# EAGLE design interface_dac_sma_feedback_3PS_LM317_ADC_detector (EAGLE 7.2.0)
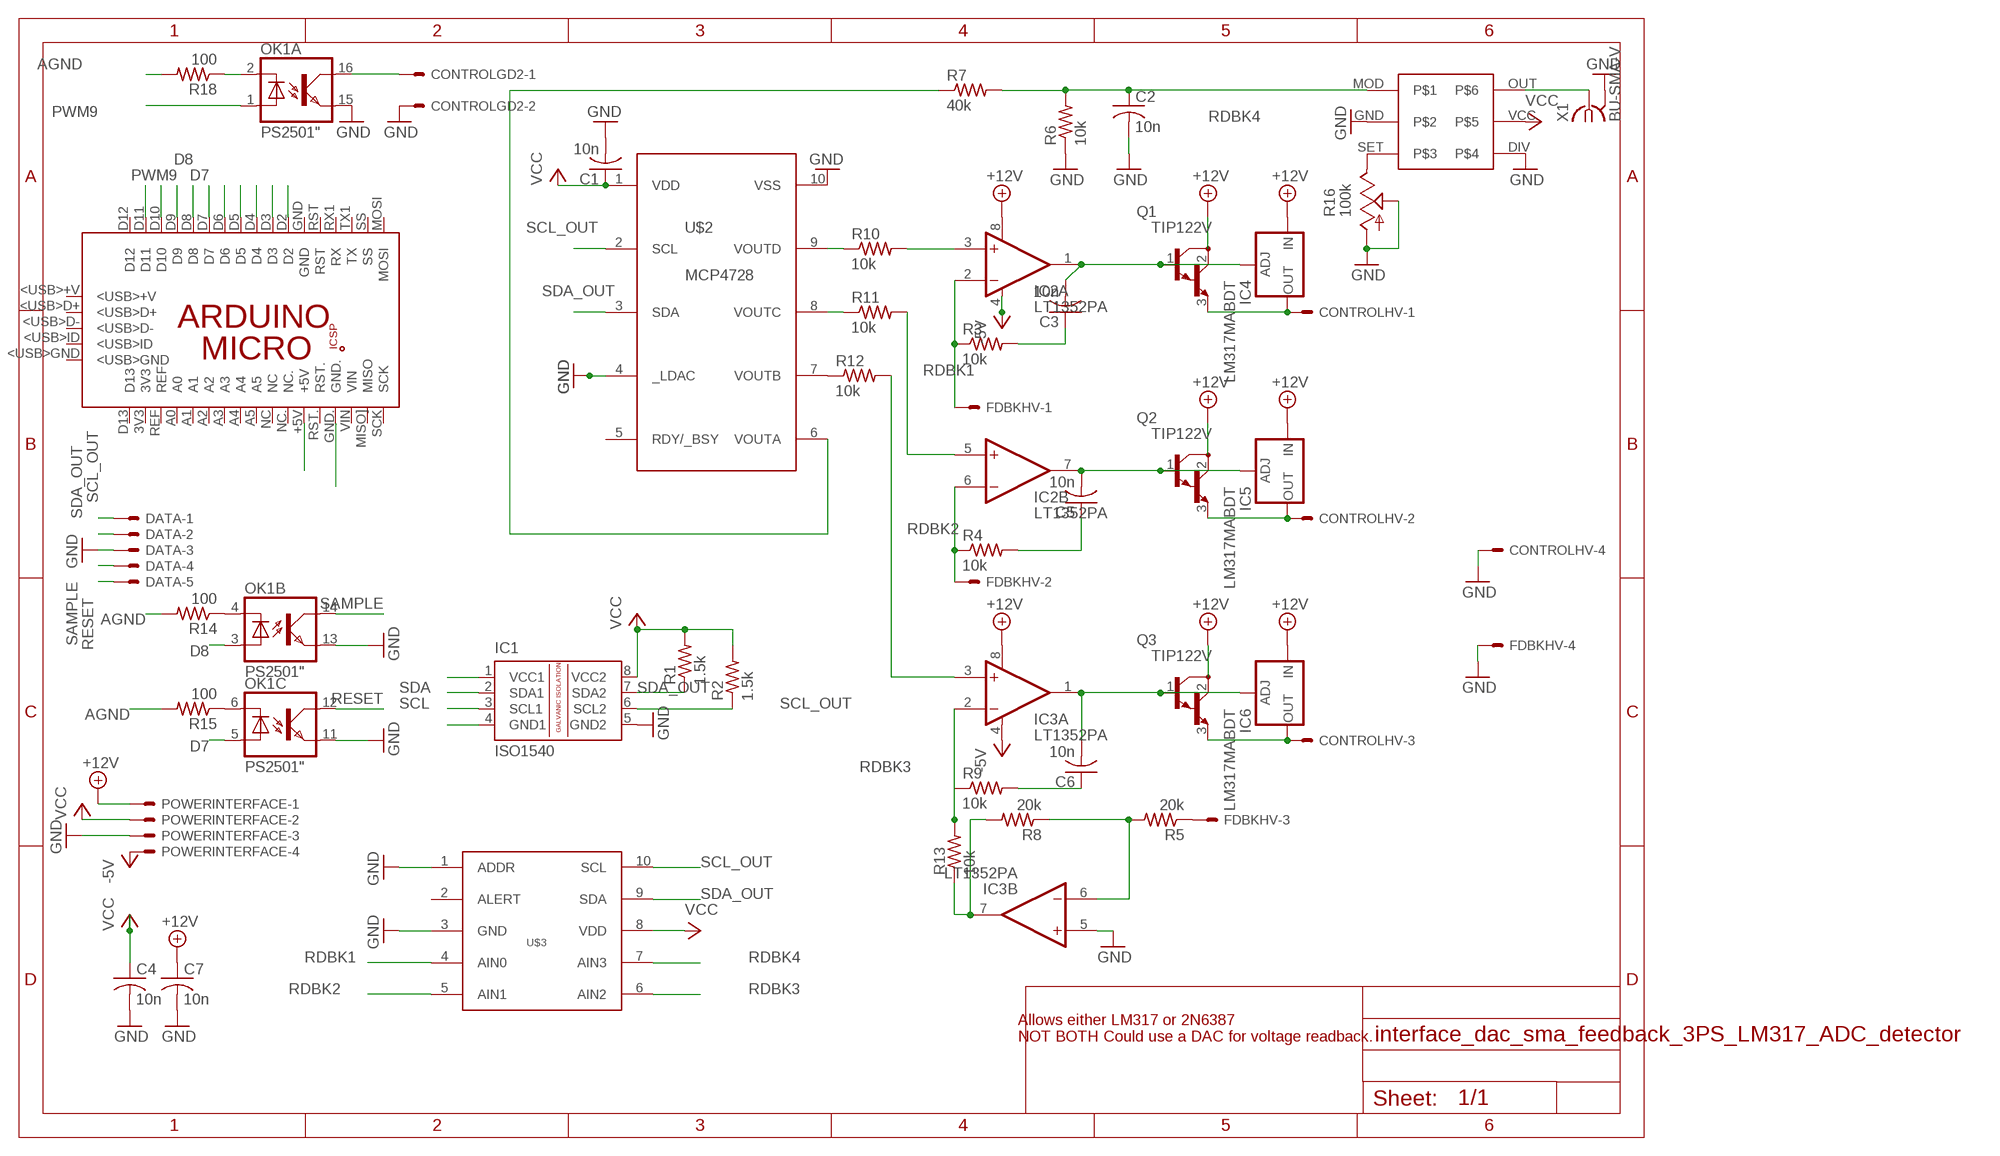
[diagram p0: schematic, sheet 1]

## Parts
C1  10n  C-US050-024X044  [C050-024X044]
C2  10n  C-US050-024X044  [C050-024X044]
C3  10n  C-US050-024X044  [C050-024X044]
C4  10n  C-US050-024X044  [C050-024X044]
C5  10n  C-US050-024X044  [C050-024X044]
C6  10n  C-US050-024X044  [C050-024X044]
C7  10n  C-US050-024X044  [C050-024X044]
CONTROLGD2  KK-156-2  [KK-156-2]
CONTROLHV  KK-156-4  [KK-156-4]
DATA  KK-156-5  [KK-156-5]
FDBKHV  KK-156-4  [KK-156-4]
IC1  ISO1540  [DIL08]
IC2  LT1352PA  [DIL08]
IC3  LT1352PA  [DIL08]
IC4  LM317MABDT  [DPACK]
IC5  LM317MABDT  [DPACK]
IC6  LM317MABDT  [DPACK]
OK1  PS2501"  [DIL16]
PCB1  ARDUINO_MICRO  [ARDUINO_MICRO]
POWERINTERFACE  KK-156-4  [KK-156-4]
Q1  TIP122V  [TO220V]
Q2  TIP122V  [TO220V]
Q3  TIP122V  [TO220V]
R1  1.5k  R-US_0207/12  [0207/12]
R2  1.5k  R-US_0207/12  [0207/12]
R3  10k  R-US_0207/12  [0207/12]
R4  10k  R-US_0207/12  [0207/12]
R5  20k  R-US_0207/12  [0207/12]
R6  10k  R-US_0207/12  [0207/12]
R7  40k  R-US_0207/12  [0207/12]
R8  20k  R-US_0207/12  [0207/12]
R9  10k  R-US_0207/12  [0207/12]
R10  10k  R-US_0207/12  [0207/12]
R11  10k  R-US_0207/12  [0207/12]
R12  10k  R-US_0207/12  [0207/12]
R13  10k  R-US_0207/12  [0207/12]
R14  100  R-US_0207/12  [0207/12]
R15  100  R-US_0207/12  [0207/12]
R16  100k  TRIM_US-B90P  [SP19L]
R18  100  R-US_0207/12  [0207/12]
U$1  LTC6992  [DIL06]
U$2  MCP4728DIL  [DIL10]
U$3  ADS1015DIL  [DIL10]
X1  BU-SMA-V  [BU-SMA-V]

## Nets
+12V: C7.1 IC2.8(A:V+) IC3.8(A:V+) IC4.3(IN) IC5.3(IN) IC6.3(IN) POWERINTERFACE.1 Q1.2(C) Q2.2(C) Q3.2(C)
-5V: IC2.4(A:V-) IC3.4(A:V-) POWERINTERFACE.4
A+5: IC1.1(VCC1) PCB1.+5V
AGND: IC1.4(GND1) PCB1.GND. R14.2 R15.2 R18.2
D4: PCB1.D4
D7: OK1.5(C:A) PCB1.D7
D8: OK1.3(B:A) PCB1.D8
D10: PCB1.D10
D11: PCB1.D11
ENSW2: CONTROLGD2.1 OK1.16(A:COL)
GND: C1.2 C2.2 C4.2 C7.2 CONTROLGD2.2 CONTROLHV.4 DATA.3 FDBKHV.4 IC1.5(GND2) IC3.5(B:+IN) OK1.11(C:EMI) OK1.13(B:EMI) OK1.15(A:EMI) POWERINTERFACE.3 R6.1 R16.A R16.S U$1.DIV U$1.GND U$2.4(_LDAC) U$2.10(VSS) U$3.1(ADDR) U$3.3(GND) X1.2 X1.3 X1.4 X1.5
N$1: R7.1 U$2.6(VOUTA)
N$2: OK1.4(B:C) R14.1
N$3: C3.1 R3.2
N$4: CONTROLHV.1 IC4.4(OUT) Q1.3(E)
N$5: CONTROLHV.3 IC6.4(OUT) Q3.3(E)
N$6: OK1.6(C:C) R15.1
N$7: OK1.2(A:C) R18.1
N$9: FDBKHV.3 R5.1
N$10: C5.2 IC2.7(B:OUT) IC5.1(ADJ) Q2.1(B)
N$11: CONTROLHV.2 IC5.4(OUT) Q2.3(E)
N$12: R16.E U$1.SET
N$13: U$1.OUT X1.1
N$14: IC3.7(B:OUT) R8.2 R13.1
N$15: C5.1 R4.2
N$16: IC2.3(A:+IN) R10.2
N$17: IC2.5(B:+IN) R11.2
N$18: IC3.3(A:+IN) R12.2
N$19: C3.2 IC2.1(A:OUT) IC4.1(ADJ) Q1.1(B)
N$20: C6.1 R9.2
N$21: C6.2 IC3.1(A:OUT) IC6.1(ADJ) Q3.1(B)
N$23: IC3.6(B:-IN) R5.2 R8.1
N$24: R10.1 U$2.9(VOUTD)
N$25: R12.1 U$2.7(VOUTB)
N$26: R11.1 U$2.8(VOUTC)
PWM5: PCB1.D5
PWM6: PCB1.D6
PWM9: OK1.1(A:A) PCB1.D9
RDBK1: FDBKHV.1 IC2.2(A:-IN) R3.1 U$3.4(AIN0)
RDBK2: FDBKHV.2 IC2.6(B:-IN) R4.1 U$3.5(AIN1)
RDBK3: IC3.2(A:-IN) R9.1 R13.2 U$3.6(AIN2)
RDBK4: C2.1 R6.2 R7.2 U$1.MOD U$3.7(AIN3)
RESET: DATA.5 OK1.12(C:COL)
SAMPLE: DATA.4 OK1.14(B:COL)
SCL: IC1.3(SCL1) PCB1.D3
SCL_OUT: DATA.1 IC1.6(SCL2) R2.1 U$2.2(SCL) U$3.10(SCL)
SDA: IC1.2(SDA1) PCB1.D2
SDA_OUT: DATA.2 IC1.7(SDA2) R1.1 U$2.3(SDA) U$3.9(SDA)
VCC: C1.1 C4.1 IC1.8(VCC2) POWERINTERFACE.2 R1.2 R2.2 U$1.VCC U$2.1(VDD) U$3.8(VDD)
Unconnected: OK1.7(D:A) OK1.8(D:C) OK1.9(D:EMI) OK1.10(D:COL) PCB1.3V3 PCB1.5V PCB1.<USB>+V PCB1.<USB>D+ PCB1.<USB>D- PCB1.<USB>GND PCB1.<USB>ID PCB1.A0 PCB1.A1 PCB1.A2 PCB1.A3 PCB1.A4 PCB1.A5 PCB1.D12 PCB1.D13 PCB1.GND PCB1.GND_ PCB1.MISO. PCB1.MISO](MISO) PCB1.MOSI PCB1.MOSI. PCB1.NC PCB1.NC. PCB1.REF PCB1.RESET.. PCB1.RST PCB1.RST. PCB1.RX1(RX) PCB1.SCK PCB1.SCK. PCB1.SS PCB1.TX1(TX) PCB1.VIN U$2.5(RDY/_BSY) U$3.2(ALERT)

## Notes on the sheet
- Allows either LM317 or 2N6387
  NOT BOTH Could use a DAC for voltage readback.

## Library data of the parts
C1 = rcl:C-US: CAPACITOR, American symbol
C2-C7 = resistor:C-US: CAPACITOR, American symbol
CONTROLGD2 = con-molex:KK-156-2: KK 156 HEADER Source: http://www.molex.com/pdm_docs/sd/026604100_sd.pdf; OC_FARNELL: unknown; OC_NEWARK: unknown
CONTROLHV FDBKHV POWERINTERFACE = con-molex:KK-156-4: KK 156 HEADER Source: http://www.molex.com/pdm_docs/sd/026604100_sd.pdf; OC_FARNELL: unknown; OC_NEWARK: unknown
DATA = con-molex:KK-156-5: KK 156 HEADER Source: http://www.molex.com/pdm_docs/sd/026604100_sd.pdf; OC_FARNELL: unknown; OC_NEWARK: unknown
IC1 = texas:ISO1540: ISOLATED CAN TRANSCEIVER Source: http://focus.ti.com/lit/ds/symlink/iso1050.pdf
IC2 IC3 = linear-technology:LT1352: Dual Operational Amplifiers Source: http://datasheets.maxim-ic.com/en/ds/ICL7612-ICL764X.pdf; OC_FARNELL: unknown; OC_NEWARK: unknown
IC4-IC6 = v-reg:LM317?*: 500 mA Adjustable Output Positive Voltage Regulator Source: http://www.onsemi.co.jp .. LM317M-D.PDF
OK1 = optocoupler:PS2501: SHARP OPTO COUPLER
PCB1 = E14_Arduino_published:ARDUINO_MICRO: Device for representing an Arduino Micro board with a footprint in an EAGLE design. Created by Dave Young for Element14. More EAGLE documentation at: http://www.element14.com/community/community/knode/cadsoft_eagle
Q1-Q3 = transistor-npn:TIP122*: NPN Darlington Transistor
R1-R13 = resistor:R-US_: RESISTOR, American symbol
R14 R15 R18 = rcl:R-US_: RESISTOR, American symbol
R16 = pot:TRIM_US-: POTENTIOMETER
U$1 = linear-technology:LTC6992
U$2 = microchip:MCP4728
U$3 = texas:ADS1015
X1 = con-coax:BU-SMA-V: FEMALE SMA CONNECTOR Radiall distributor RS 112-3794; OC_FARNELL: unknown; OC_NEWARK: unknown

## Board
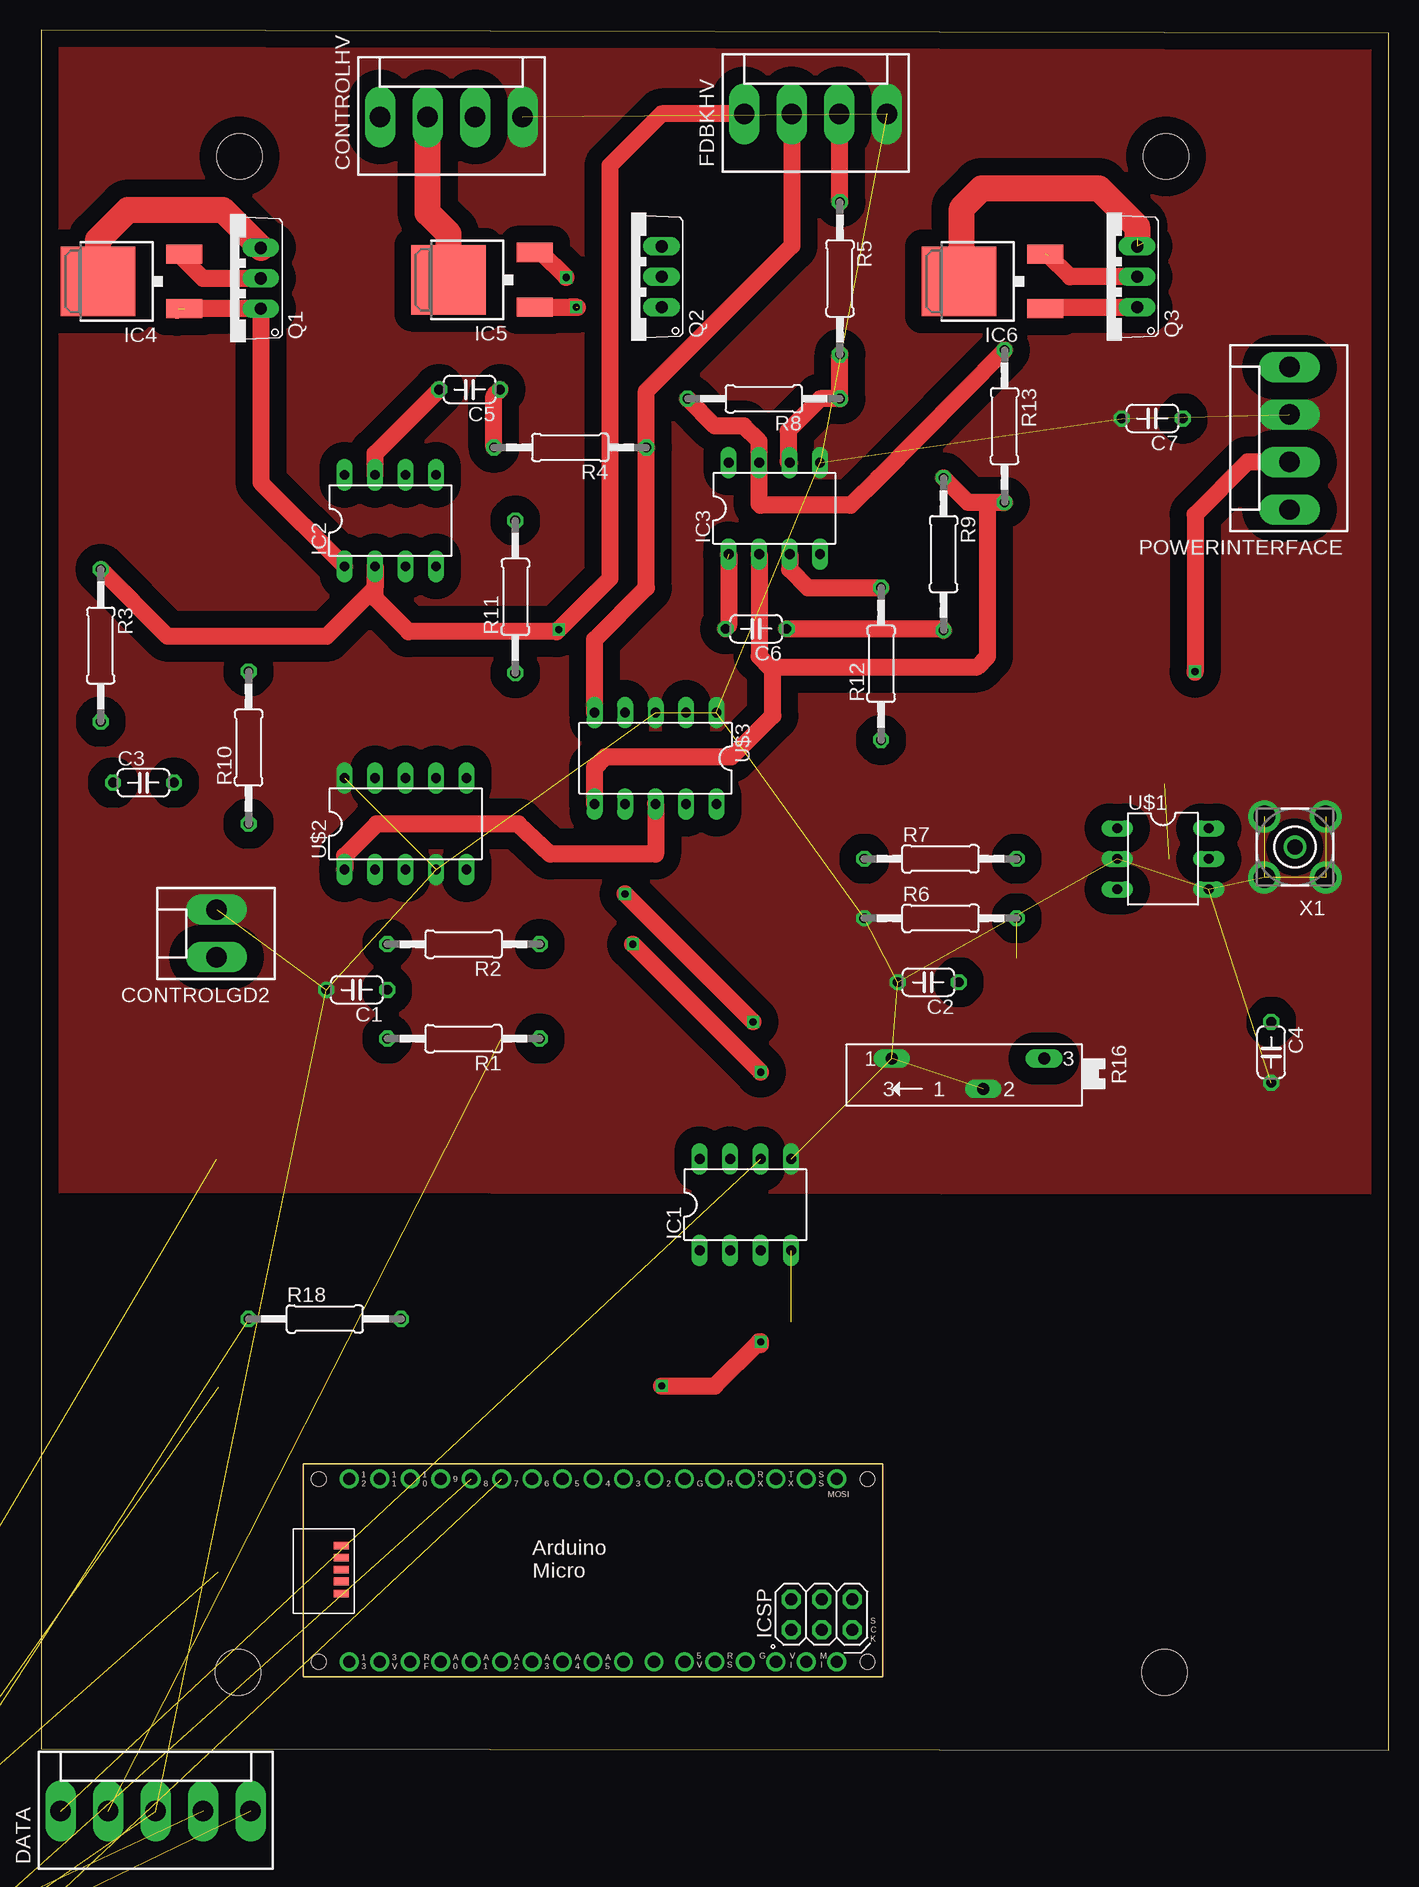
[diagram p1: board, top side]
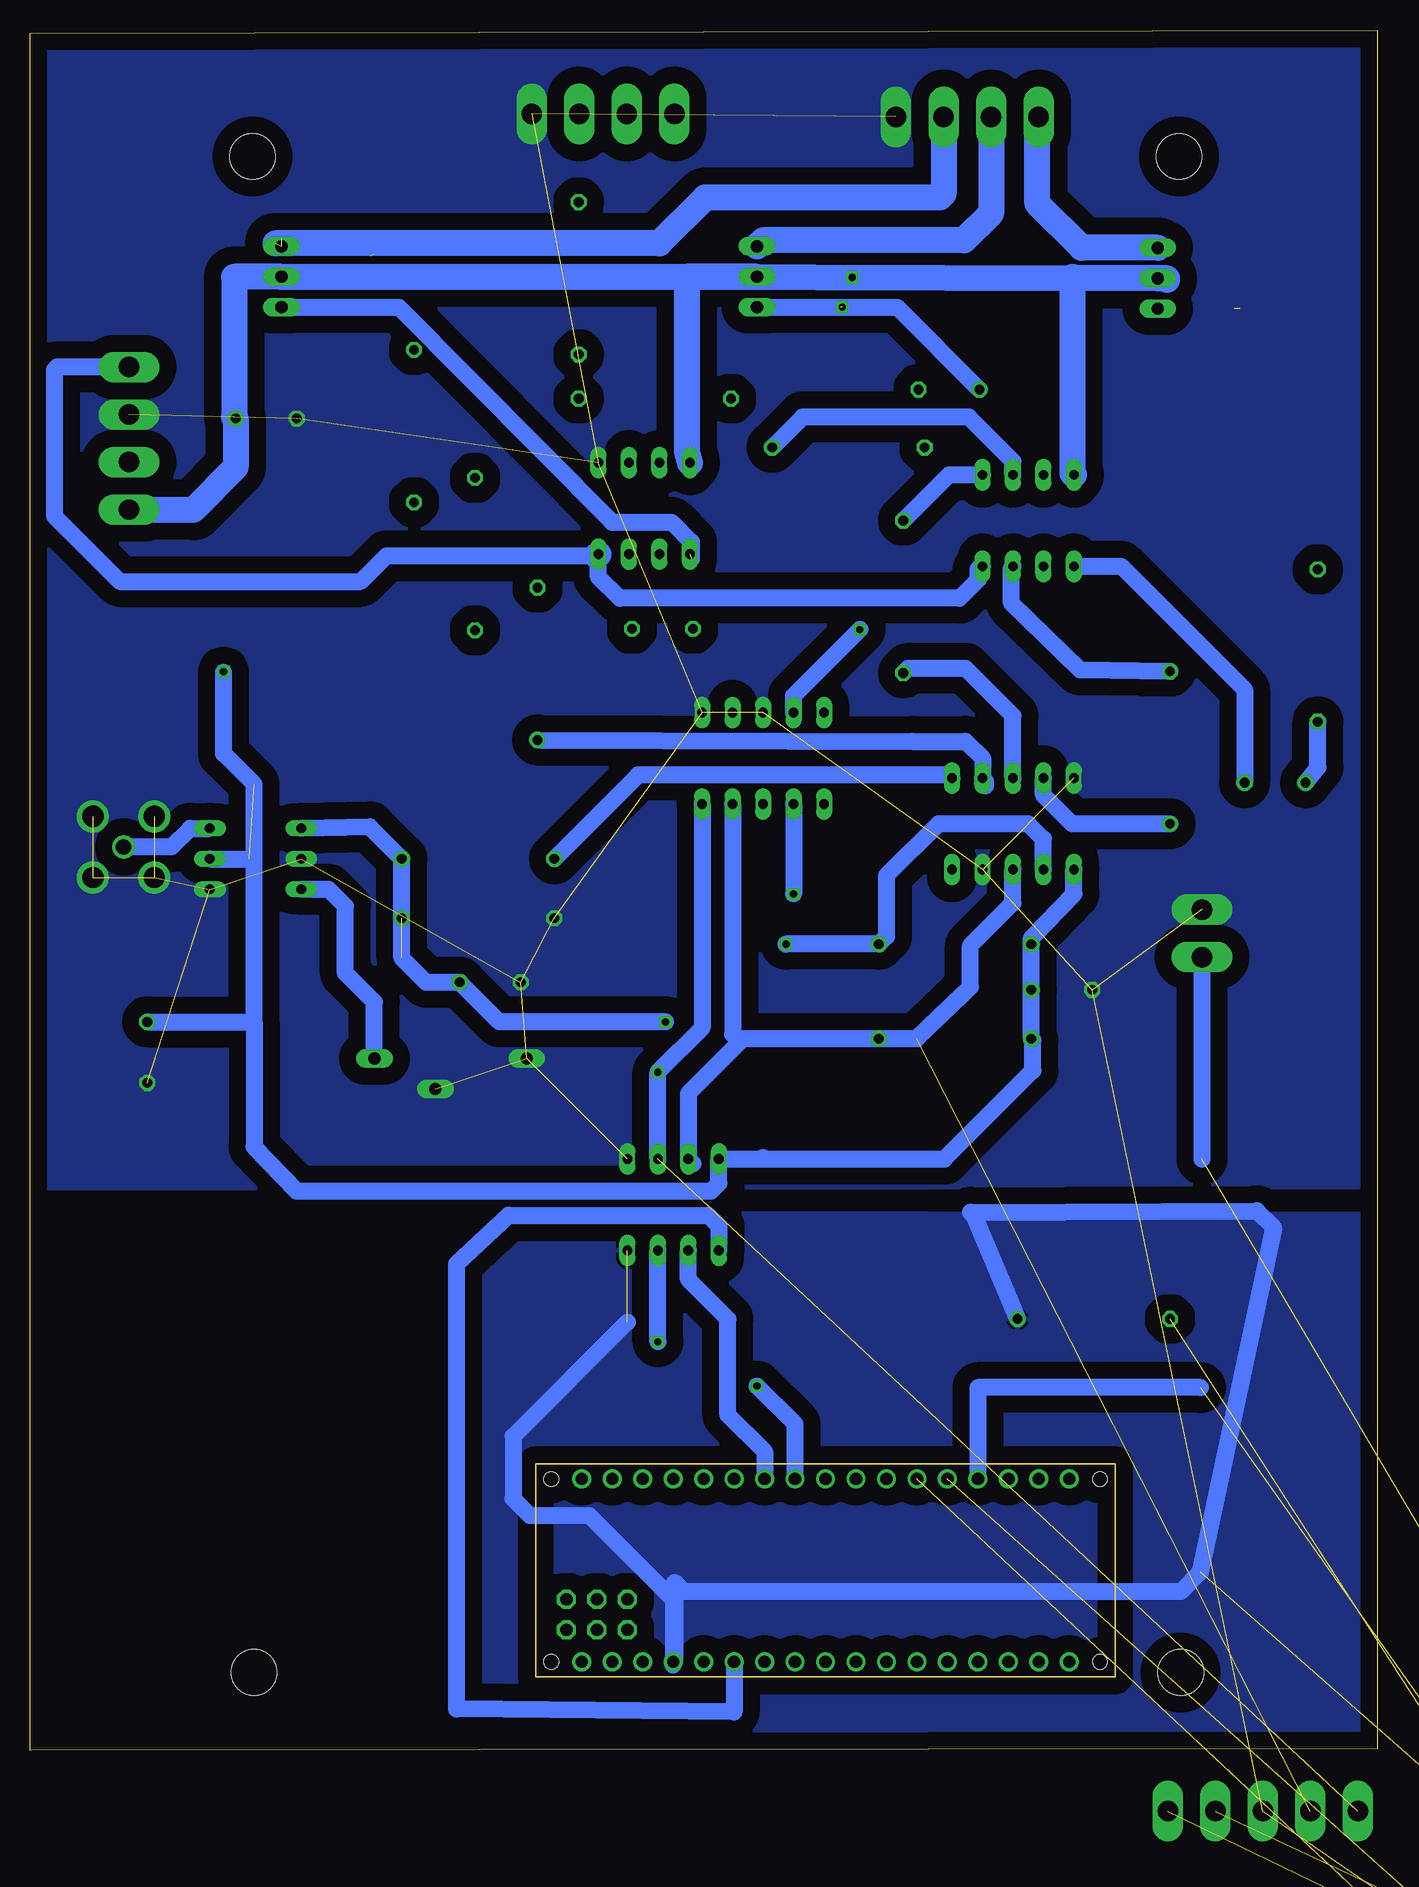
[diagram p2: board, bottom side, seen from below]

Size 112.27 x 143.38 mm. Coordinates in mm from the lower left corner, seen from the top.
Outline: 0,0.13 112.27,0 112.27,143.13 0,143.38 0,0.13
Copper layers (1*16): Top 0.035mm / dielectric 1.5mm / Bottom 0.035mm
Design rules "default *": minimum track width 6mil, minimum drill 15mil, track to track 6mil, track to pad 6mil, pad to pad 6mil, via to via 6mil, smd to smd 6mil, copper to edge 40mil, drill to drill 8mil, minimum pad ring 10mil, minimum via ring 8mil, stop-mask expansion 4mil, vias tented up to drill 0mil, thermal gap 10mil
Holes 3.8 mm at 93.6,6.48 93.73,132.84 16.51,132.84 16.38,6.48

### Footprints (pad centres in the part's own frame; a part is rotated, then mirrored left to right if it is on the bottom)
C050-024X044 = drill 0.813 octagon: 1 -2.54,0; 2 2.54,0
KK-156-2 = drill 1.7 pad 2.184 long: 1 -1.98,0; 2 1.98,0
KK-156-4 = drill 1.7 pad 2.184 long: 1 -5.94,0; 2 -1.98,0; 3 1.98,0; 4 5.94,0
KK-156-5 = drill 1.7 pad 2.184 long: 1 -7.92,0; 2 -3.96,0; 3 0,0; 4 3.96,0; 5 7.92,0
DIL08 = drill 0.813 long: 1 -3.81,-3.81; 2 -1.27,-3.81; 3 1.27,-3.81; 4 3.81,-3.81; 5 3.81,3.81; 6 1.27,3.81; 7 -1.27,3.81; 8 -3.81,3.81
DPACK = smd 1.6 x 3: 1 -2.28,-4.8; 3 2.28,-4.8 | smd 5.8 x 6.2: 4 0,2.38
DIL16 = drill 0.813 offset: 1 -8.89,-3.81; 2 -6.35,-3.81; 3 -3.81,-3.81; 4 -1.27,-3.81; 5 1.27,-3.81; 6 3.81,-3.81; 7 6.35,-3.81; 8 8.89,-3.81; 9 8.89,3.81; 10 6.35,3.81; 11 3.81,3.81; 12 1.27,3.81; 13 -1.27,3.81; 14 -3.81,3.81; 15 -6.35,3.81; 16 -8.89,3.81
ARDUINO_MICRO = drill 1.016 pad 1.575: 3V3 6.35,1.27; +5V 31.75,1.27; A0 11.43,1.27; A1 13.97,1.27; A2 16.51,1.27; A3 19.05,1.27; A4 21.59,1.27; A5 24.13,1.27; D2 29.21,16.51; D3 26.67,16.51; D4 24.13,16.51; D5 21.59,16.51; D6 19.05,16.51; D7 16.51,16.51; D8 13.97,16.51; D9 11.43,16.51; D10 8.89,16.51; D11 6.35,16.51; D12 3.81,16.51; D13 3.81,1.27; GND 31.75,16.51; GND. 36.83,1.27; MISO] 41.91,1.27; MOSI 44.45,16.51; NC 26.67,1.27; NC. 29.21,1.27; REF 8.89,1.27; RST 34.29,16.51; RST. 34.29,1.27; RX1 36.83,16.51; SCK 44.45,1.27; SS 41.91,16.51; TX1 39.37,16.51; VIN 39.37,1.27 | drill 1.016 pad 1.575 octagon: 5V 40.64,6.477; GND_ 45.72,6.477; MISO. 40.64,3.937; MOSI. 43.18,6.477; RESET.. 45.72,3.937; SCK. 43.18,3.937 | smd 1.27 x 0.635: <USB>+V 3.15,10.947; <USB>D+ 3.15,9.957; <USB>D- 3.15,8.941; <USB>GND 3.15,6.96; <USB>ID 3.15,7.976 | hole 1.2: 1.27,1.27; 1.27,16.51; 46.99,16.51; 46.99,1.27
TO220V = drill 1.016 long: 1 -2.54,-2.54; 2 0,-2.54; 3 2.54,-2.54
0207/12 = drill 0.813 octagon: 1 -6.35,0; 2 6.35,0
SP19L = drill 1.016 long: A 5.715,-1.27; E -6.985,-1.27; S -1.905,1.27
DIL06 = drill 0.813 long: DIV 2.54,3.81; GND 0,-3.81; MOD -2.54,-3.81; OUT -2.54,3.81; SET 2.54,-3.81; VCC 0,3.81
DIL10 = drill 0.813 long: 1 -5.08,-3.81; 2 -2.54,-3.81; 3 0,-3.81; 4 2.54,-3.81; 5 5.08,-3.81; 6 5.08,3.81; 7 2.54,3.81; 8 0,3.81; 9 -2.54,3.81; 10 -5.08,3.81
BU-SMA-V = drill 1.27: 1 0,0 | drill 1.778: 2 -2.55,2.55; 3 2.55,2.55; 4 2.55,-2.55; 5 -2.55,-2.55

### Placement (x,y rotation side)
C1  26.29,63.37 180 top
C2  73.91,64.01 180 top
C3  8.51,80.64 0 top
C4  102.49,58.17 270 top
C5  35.69,113.41 180 top
C6  59.56,93.47 180 top
C7  92.58,111 180 top
CONTROLGD2  14.61,68.07 90 top
CONTROLHV  34.16,136.14 0 top
DATA  9.53,-5.08 0 top  (outside the outline)
FDBKHV  64.52,136.4 0 top
IC1  58.67,45.47 0 top
IC2  29.08,102.49 0 top
IC3  61.09,103.5 0 top
IC4  7.11,122.43 90 top
IC5  36.32,122.55 90 top
IC6  78.87,122.43 90 top
OK1  -18.54,-25.65 0 top  (outside the outline)
PCB1  21.84,6.1 0 top
POWERINTERFACE  104.01,109.35 90 top
Q1  15.75,122.68 90 top
Q2  49.15,122.81 90 top
Q3  88.77,122.81 90 top
R1  35.18,59.31 180 top
R2  35.18,67.18 180 top
R3  4.95,92.07 270 top
R4  44.07,108.58 180 top
R5  66.55,122.68 270 top
R6  74.93,69.34 0 top
R7  74.93,74.3 0 top
R8  60.2,112.65 180 top
R9  75.18,99.69 270 top
R10  17.27,83.57 90 top
R11  39.5,96.14 90 top
R12  69.98,90.55 90 top
R13  80.26,110.36 270 top
R14  -23.5,-13.21 0 top  (outside the outline)
R15  -23.5,-17.53 0 top  (outside the outline)
R16  76.58,56.39 180 top
R18  23.62,35.94 0 top
U$1  93.47,74.3 270 top
U$2  30.35,77.22 0 top
U$3  51.18,82.68 180 top
X1  104.47,75.29 180 top

### Tracks (layer width: path | path; a pad name or v marks a point on that pad's centre or on a via)
+12V  (via drill 0.6)  (1 unrouted)
  Top 1.422: IC4.3 11.91,124.23 13.46,122.68 Q1.2 | IC5.3 41.66,124.83 v43.74,122.76 | Q3.2 85.72,122.81 83.95,124.59 83.19,124.59
  Bottom 1.422: v43.74,122.76 51.64,122.76 Q2.2
  Bottom 2.184: 57.53,122.81 Q3.2 95.25,122.81 95.25,111.12 C7.1 95.12,106.93 98.68,103.38 98.71,103.41 POWERINTERFACE.1 | 57.53,122.81 25.27,122.68 | Q1.2 17.53,122.68 17.53,122.58 | Q1.2 25.27,122.68 | 25.27,122.68 25.4,122.81 25.4,106.43 IC2.8 | Q2.2 57.53,122.81 | 57.53,122.81 57.53,108.2 IC3.8 | 17.53,122.55 Q1.2
-5V
  Bottom 1.422: IC2.4 33.02,98.68 33.27,98.42 33.27,97.54 34.8,96.01 63.12,96.01 64.9,97.79 IC3.4 | POWERINTERFACE.4 110.01,115.29 110.24,115.06 110.24,102.87 104.78,97.41 84.71,97.41 82.55,99.57 65.02,99.57
  Bottom 2.184: 65.02,99.57 IC3.4
A+5
  Bottom 1.422: PCB1.+5V 53.59,3.17 76.71,3.43 76.71,40.51 72.39,44.58 55.75,44.58 54.86,43.69 IC1.1
AGND  (3 unrouted)
  Bottom 1.422: 62.48,35.69 72.01,26.16 72.01,20.95 70.61,19.56 65.66,19.56 58.67,12.57 PCB1.GND. | PCB1.GND. 58.67,7.11 | R18.2 33.53,44.45 33.91,44.83 10.03,44.96 8.64,43.56 14.73,14.86 16.38,13.21 57.78,13.21 58.55,13.97 58.55,7.49 PCB1.GND.
  pour Bottom (isolate 1.422): -0.13,0.25 112.52,0.25 112.52,44.83 0,44.7
D7  (1 unrouted)
D8  (1 unrouted)
ENSW2  (1 unrouted)
  Bottom 1.422: CONTROLGD2.1 14.61,49.28
GND  (26 unrouted)
  pour Bottom (isolate 1.422, no thermals): 0,143.13 112.27,143 112.27,46.86 0,46.99
  pour Top (isolate 1.422, no thermals): 0,143.26 112.39,143.13 112.39,46.48 0,46.61
N$1
  Bottom 1.422: R7.1 61.59,81.28 35.69,81.28 U$2.6
N$2  (1 unrouted)
N$3
  Bottom 1.422: C3.1 4.95,81.91 R3.2
N$4
  Top 2.184: IC4.4 4.73,125.89 7.24,128.4 15.11,128.4 Q1.3
  Bottom 2.184: Q1.3 24.64,125.22 28.32,128.91 28.32,136.05 CONTROLHV.1
N$5  (2 unrouted)
  Top 2.184: IC6.4 76.71,122.65 76.71,128.52 78.36,130.18 88.14,130.18 91.31,127 91.31,125.98
  Bottom 2.184: CONTROLHV.3 36.14,129.72 36.45,129.41 56.01,129.41 59.82,125.6 91.82,125.6
N$6  (1 unrouted)
N$7  (1 unrouted)
N$9
  Top 1.422: R5.1 66.55,136.35 FDBKHV.3
N$10  (via drill 0.6)  (1 unrouted)
  Top 1.422: IC2.7 27.81,108.08 C5.2 | IC5.1 44.7,120.27 43.94,120.27
  Bottom 1.422: Q2.1 v44.58,120.27 40.01,120.27 C5.2
N$11
  Top 2.184: IC5.4 33.94,126.38 32.18,128.14 CONTROLHV.2
  Bottom 2.184: CONTROLHV.2 32.18,128.09 34.42,125.86 51.18,125.86 Q2.3
N$12
  Bottom 1.422: R16.E 83.57,62.36 85.98,64.77 85.98,70.36 87.38,71.75 U$1.SET
N$13
  Bottom 1.422: X1.1 104.19,75.31 100.46,75.31 98.93,76.83 U$1.OUT
N$14
  Top 1.422: R13.1 69.72,106.05 67.44,103.76 59.94,103.76 59.82,103.89 IC3.7 59.82,109.09 58.55,110.36 56.13,110.36 R8.2
N$15
  Top 1.422: R4.2 37.72,112.9 C5.1
N$16
  Bottom 1.422: R10.2 24.77,90.04 30.48,95.63 30.48,98.55 IC2.3
N$17
  Bottom 1.422: IC2.5 35.69,106.3 R11.2
N$18
  Top 1.422: IC3.3 62.36,98.42 63.88,96.9 R12.2
N$19  (1 unrouted)
  Top 1.422: IC2.1 18.29,105.66 Q1.1 11.43,120.14 11.3,120.02
  Bottom 1.422: IC2.1 21.34,98.68 11.05,88.39 C3.2
N$20
  Top 1.422: C6.1 75.06,93.47 R9.2
N$21  (1 unrouted)
  Top 1.422: IC3.1 57.28,93.73 C6.2 | IC6.1 83.79,120.27 Q3.1
  Bottom 1.422: Q3.1 81.53,120.27 63.75,102.36 58.8,102.36 57.15,100.71 57.15,99.31 57.28,99.19
N$23
  Top 1.422: IC3.6 62.23,107.44 62.23,109.98 64.9,112.65 R8.1 R5.2
N$24
  Bottom 1.422: R10.1 25.4,77.22 27.81,79.63 U$2.9
N$25
  Bottom 1.422: R12.1 38.73,84.07 34.29,84.07 32.89,82.68 U$2.7 | U$2.7 32.89,80.64 32.64,80.39 32.64,80.77 U$2.7
N$26
  Bottom 1.422: U$2.8 30.35,86.23 34.29,90.17 39.12,90.17 R11.1
PWM9  (1 unrouted)
  Bottom 1.422: 14.73,30.23 33.27,30.23 PCB1.D9
RDBK1  (via drill 0.6)
  Top 1.422: FDBKHV.1 51.69,136.4 47.37,132.08 47.37,97.66 v43.12,93.41 42.93,93.22 30.61,93.22 27.81,96.01 IC2.2 27.81,96.9 23.75,92.84 10.54,92.84 R3.1
  Bottom 1.422: U$3.4 48.64,87.88 v43.12,93.41
RDBK2
  Top 1.422: FDBKHV.2 62.54,125.4 50.42,113.28 R4.1 50.42,96.9 46.1,92.58 U$3.5
  Bottom 1.422: IC2.6 30.35,107.44 34.04,111.12 47.88,111.12 R4.1
RDBK3
  Top 1.422: R9.1 77.22,104.01 78.87,104.01 | 78.87,104.01 R13.2 | IC3.2 59.82,91.19 60.71,90.3 60.96,90.3 | 60.96,90.3 77.98,90.3 78.87,91.19 78.87,104.01 | U$3.6 46.1,81.91 46.99,82.8 57.53,82.8 60.96,86.23 60.96,90.3
RDBK4  (via drill 0.6)  (1 unrouted)
  Top 1.422: v48.64,71.37 v59.31,60.71
  Bottom 1.422: U$3.7 v48.64,71.37 | v59.31,60.71 73.15,60.71 C2.1 79.25,64.01 81.28,66.04 R7.2 83.95,76.96 U$1.MOD
RESET  (1 unrouted)
SAMPLE  (1 unrouted)
SCL  (via drill 0.6)
  Top 1.422: v51.69,30.35 56.13,30.35 59.82,34.04 59.94,33.78 v59.94,34.04
  Bottom 1.422: PCB1.D3 48.51,27.18 v51.69,30.35 | v59.94,34.04 IC1.3
SCL_OUT  (via drill 0.6)  (1 unrouted)
  Top 1.422: v49.28,67.18 v59.94,56.52
  Bottom 1.422: v49.28,67.18 R2.1 40.89,67.82 40.89,72.9 36.58,77.22 29.08,77.22 27.81,75.95 U$2.2 | IC1.6 v59.94,56.52 56.26,60.2 U$3.10
SDA
  Bottom 1.422: PCB1.D2 51.05,24.89 54.1,27.94 54.1,35.94 57.4,39.24 IC1.2
SDA_OUT  (1 unrouted)
  Bottom 1.422: 53.09,59.05 57.4,54.74 IC1.7 57.02,48.9 | 53.09,59.05 52.83,59.31 R1.1 38.35,59.31 34.54,62.99 33.91,63.63 33.91,67.06 30.35,70.61 U$2.3 | U$3.9 53.72,59.69 53.09,59.05
VCC  (via drill 0.6)  (2 unrouted)
  Top 1.422: POWERINTERFACE.2 100.51,107.37 96.14,103 v96.14,89.92 96.14,89.84 | U$3.8 51.18,74.68 42.42,74.68 39.75,77.22 27.94,77.22 25.27,74.55 U$2.1
  Bottom 1.422: C4.1 93.6,60.71 | 93.6,60.71 93.6,80.52 96.14,83.06 96.14,89.84 | 93.6,60.71 93.6,50.29 90.04,46.61 55.5,46.61 54.86,47.24 IC1.8 51.05,49.28 | 51.05,49.28 36.07,49.28 28.7,56.64 28.7,59.18 R1.2 C1.1 R2.2 28.83,67.69 25.27,71.37 U$2.1 | 51.18,49.4 51.05,49.28 | U$1.VCC 93.98,74.3